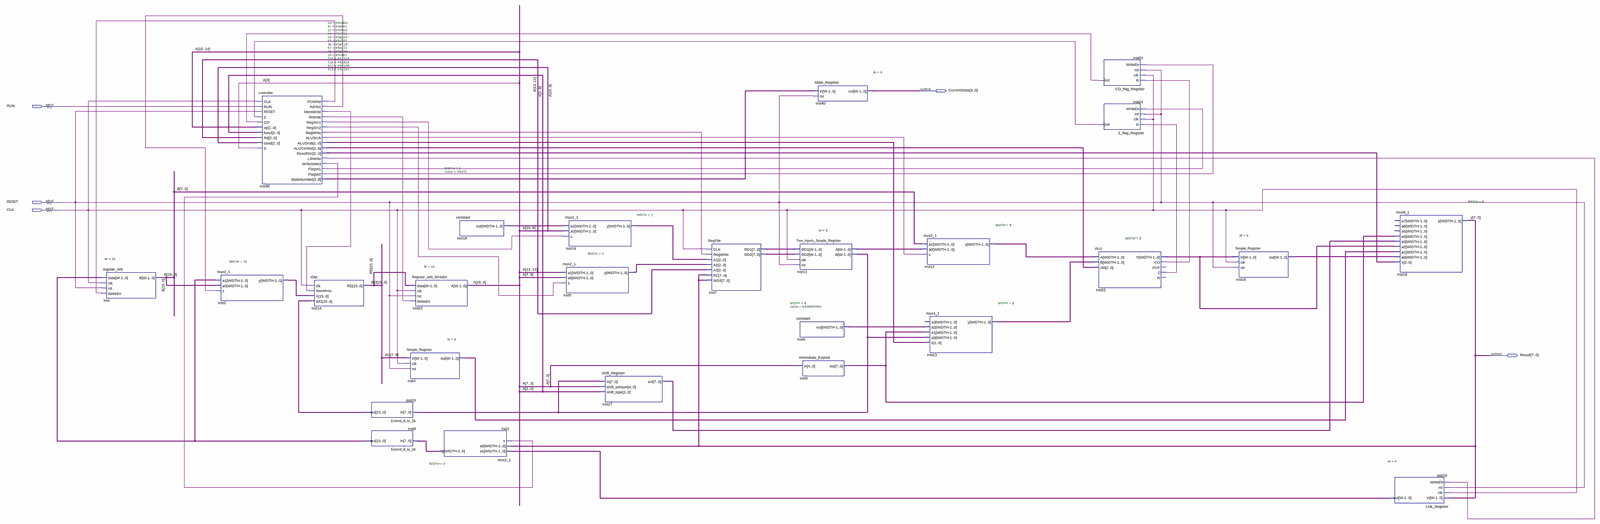
[diagram p0: schematic sheet, whole]
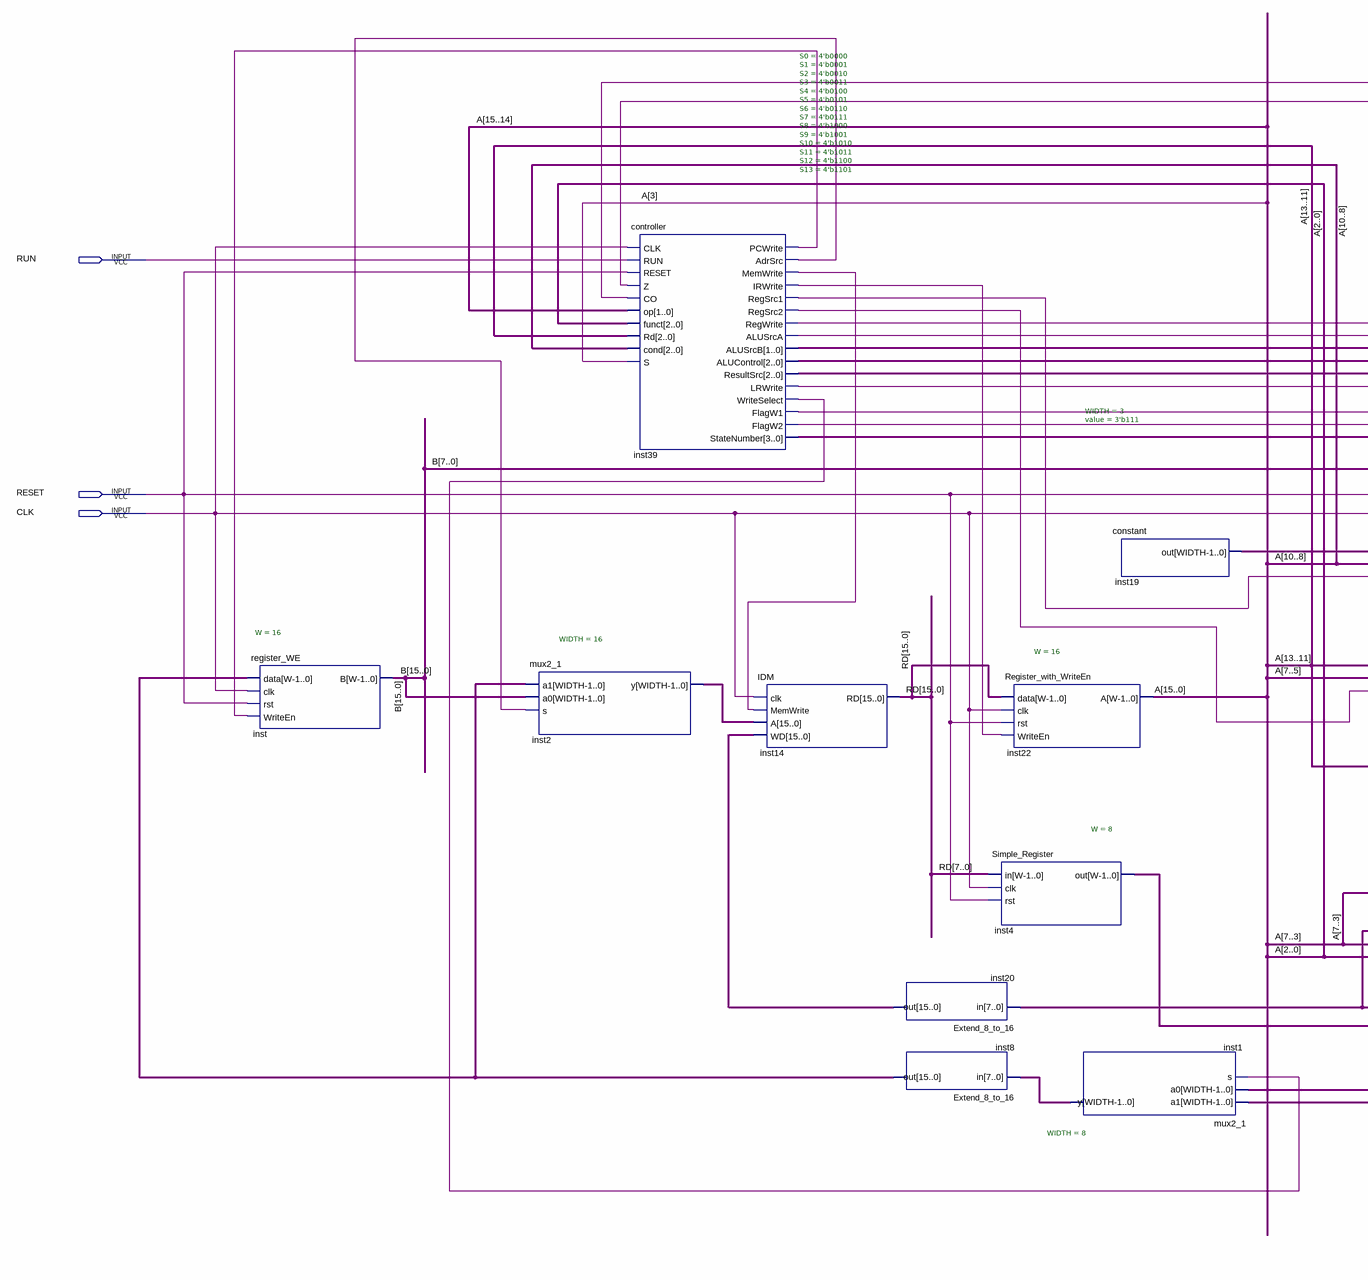
[diagram p1: schematic sheet, left part]
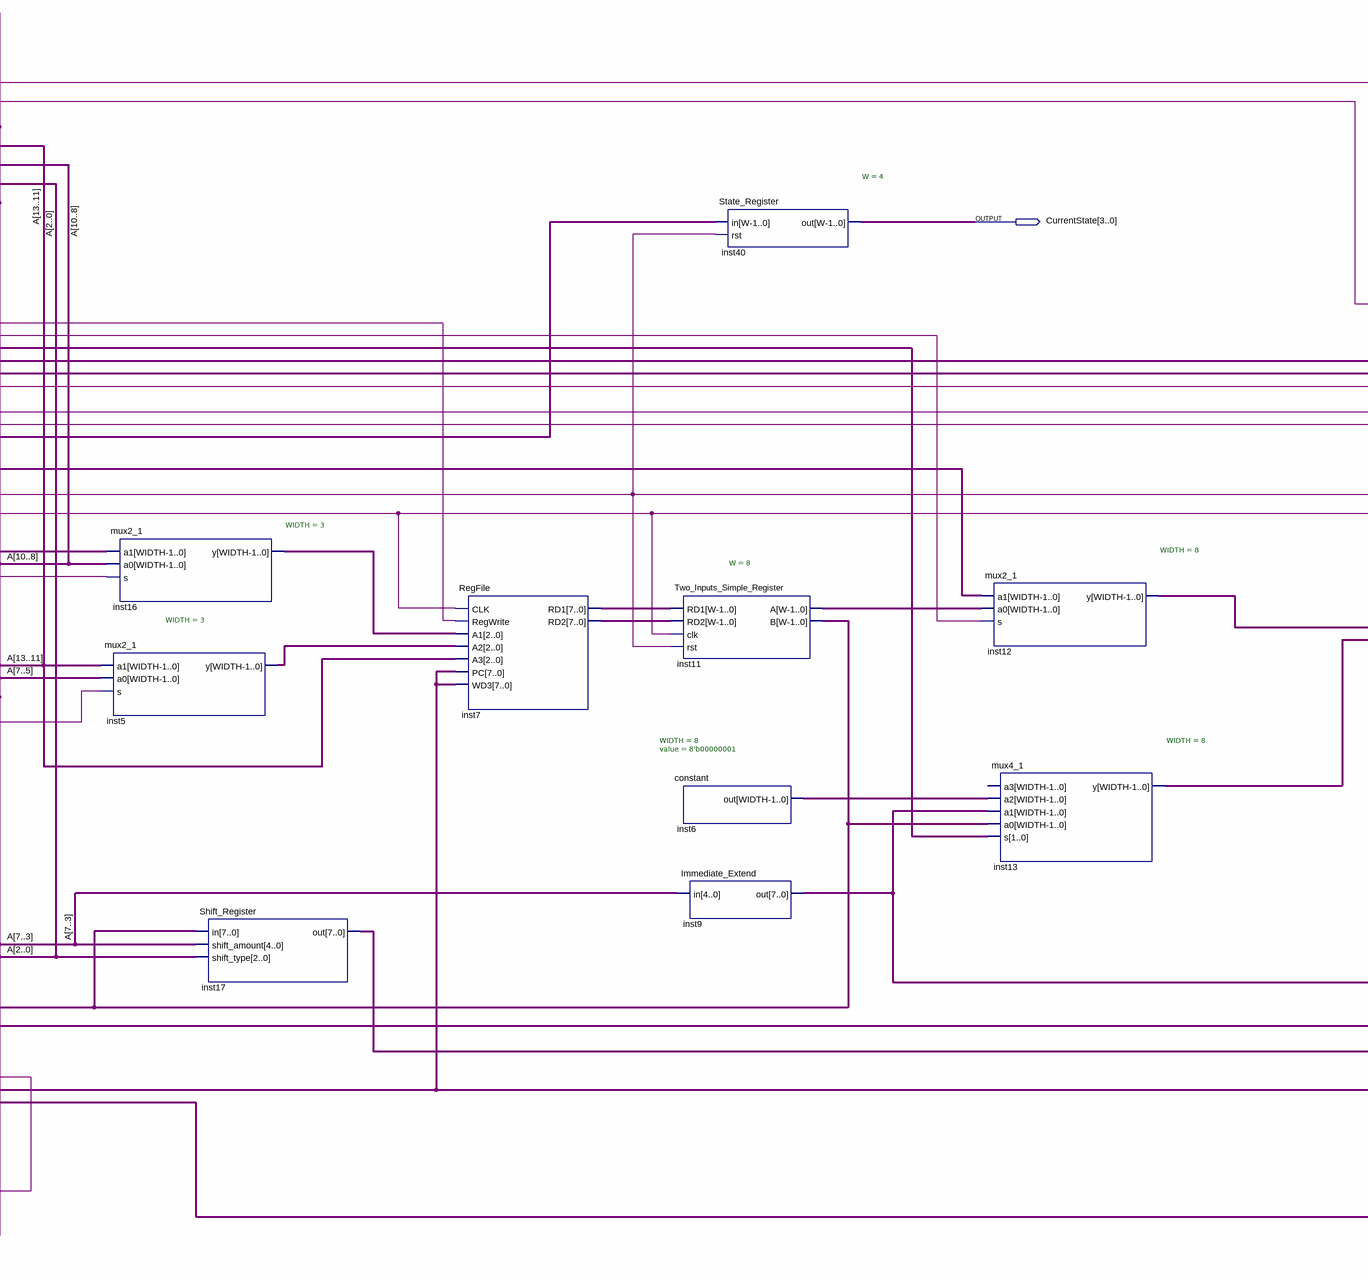
[diagram p2: schematic sheet, centre part]
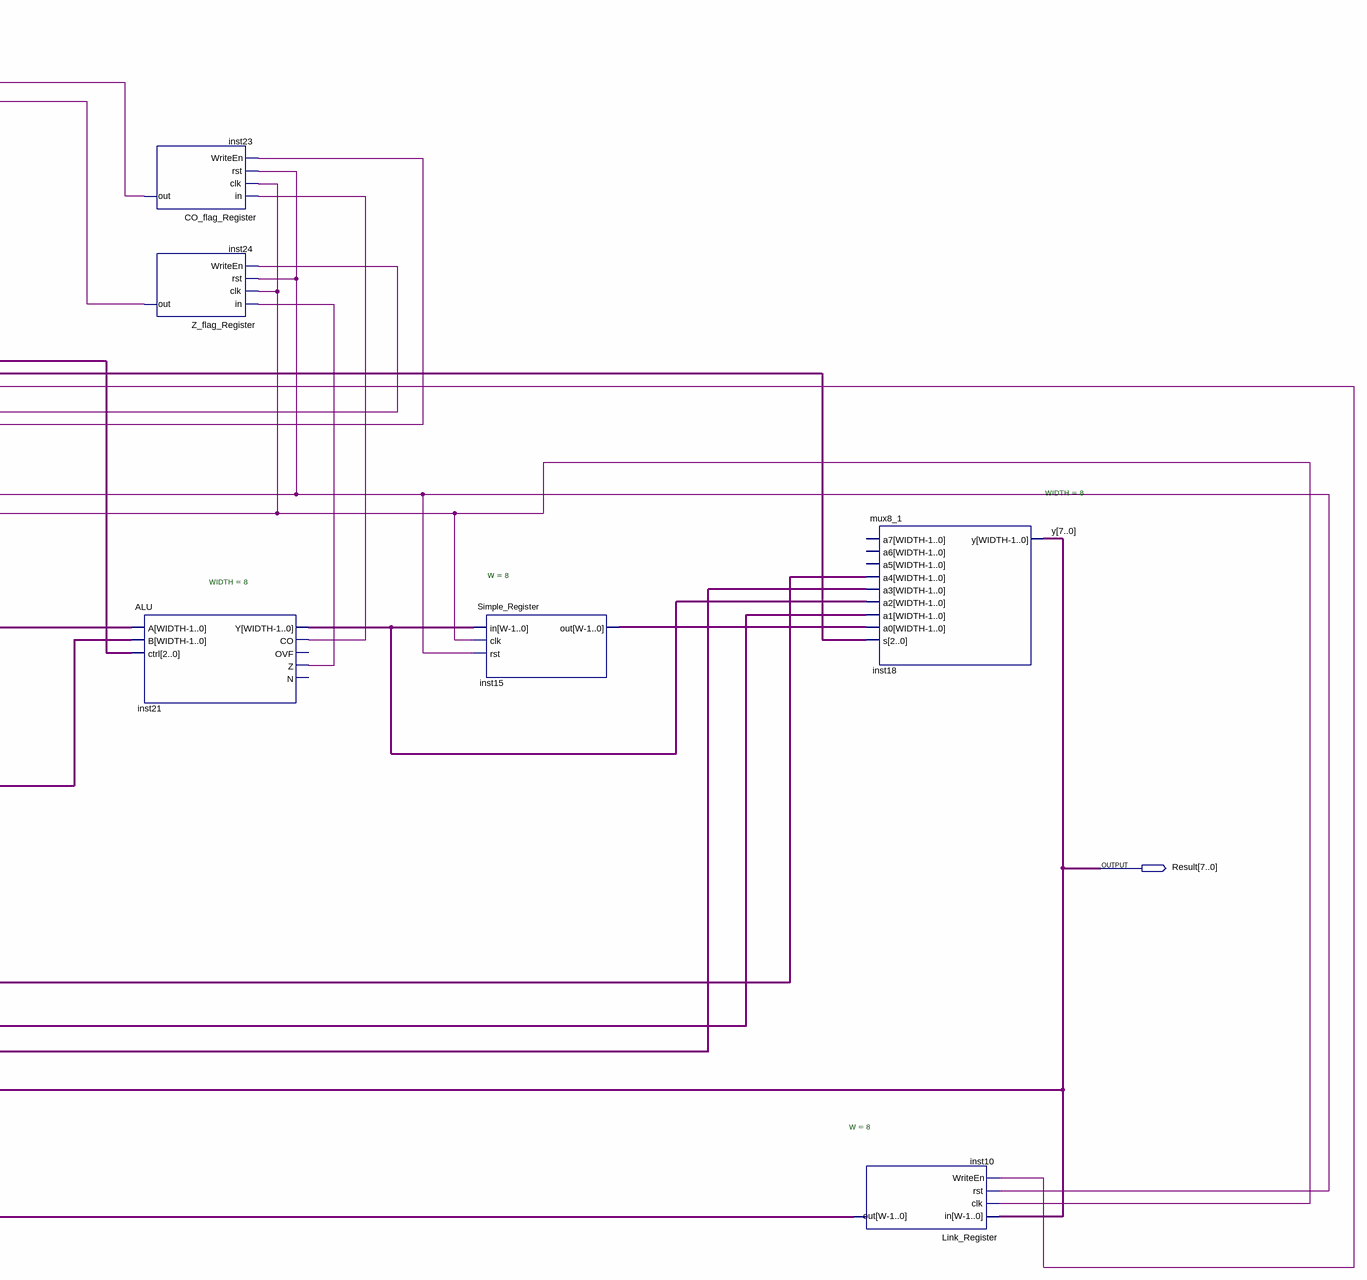
[diagram p3: schematic sheet, right part]
// Quartus schematic multicycle.bdf as structural Verilog: 26 symbols, 5 pins
module multicycle (
  input  RUN,
  input  RESET,
  input  CLK,
  output [3:0] CurrentState,
  output [7:0] Result
);

  wire inst21_co, inst21_z, inst23_out, inst24_out, inst39_adrsrc, inst39_alusrca, inst39_flagw1,
       inst39_flagw2, inst39_irwrite, inst39_lrwrite, inst39_memwrite, inst39_pcwrite, inst39_regsrc1,
       inst39_regsrc2, inst39_regwrite, inst39_writeselect;
  wire [1:0] inst39_alusrcb;
  wire [2:0] inst5_y, inst16_y, inst19_out, inst39_alucontrol, inst39_resultsrc;
  wire [3:0] inst39_statenumber;
  wire [7:0] inst1_y, inst4_out, inst6_out, inst7_rd1, inst7_rd2, inst9_out, inst10_out, inst11_a, inst11_b,
       inst12_y, inst13_y, inst15_out, inst17_out, inst21_y;
  wire [15:0] A, B, inst2_y, inst8_out, inst20_out, RD;

  register_WE #(.W(16)) inst (.data(inst8_out), .clk(CLK), .rst(RESET), .WriteEn(inst39_pcwrite), .B(B));
  mux2_1 #(.WIDTH(16)) inst2 (.a1(inst8_out), .a0(B), .s(inst39_adrsrc), .y(inst2_y));
  controller #(.S0(4'b0000), .S1(4'b0001), .S2(4'b0010), .S3(4'b0011), .S4(4'b0100), .S5(4'b0101), .S6(4'b0110), .S7(4'b0111), .S8(4'b1000), .S9(4'b1001), .S10(4'b1010), .S11(4'b1011), .S12(4'b1100), .S13(4'b1101)) inst39 (
    .CLK(CLK), .RUN(RUN), .RESET(RESET), .Z(inst24_out), .CO(inst23_out), .op(A[15:14]), .funct(A[2:0]),
    .Rd(A[13:11]), .cond(A[10:8]), .S(A[3]), .PCWrite(inst39_pcwrite), .AdrSrc(inst39_adrsrc),
    .MemWrite(inst39_memwrite), .IRWrite(inst39_irwrite), .RegSrc1(inst39_regsrc1), .RegSrc2(inst39_regsrc2),
    .RegWrite(inst39_regwrite), .ALUSrcA(inst39_alusrca), .ALUSrcB(inst39_alusrcb),
    .ALUControl(inst39_alucontrol), .ResultSrc(inst39_resultsrc), .LRWrite(inst39_lrwrite),
    .WriteSelect(inst39_writeselect), .FlagW1(inst39_flagw1), .FlagW2(inst39_flagw2),
    .StateNumber(inst39_statenumber));
  IDM inst14 (.clk(CLK), .MemWrite(inst39_memwrite), .A(inst2_y), .WD(inst20_out), .RD(RD));
  Extend_8_to_16 inst20 (.in(inst11_b), .out(inst20_out));
  Extend_8_to_16 inst8 (.in(inst1_y), .out(inst8_out));
  Register_with_WriteEn #(.W(16)) inst22 (.data(RD), .clk(CLK), .rst(RESET), .WriteEn(inst39_irwrite), .A(A));
  Simple_Register #(.W(8)) inst4 (.in(RD[7:0]), .clk(CLK), .rst(RESET), .out(inst4_out));
  mux2_1 #(.WIDTH(8)) inst1 (.a1(inst10_out), .a0(Result), .s(inst39_writeselect), .y(inst1_y));
  constant #(.WIDTH(3), .value(3'b111)) inst19 (.out(inst19_out));
  mux2_1 #(.WIDTH(3)) inst16 (.a1(inst19_out), .a0(A[10:8]), .s(inst39_regsrc1), .y(inst16_y));
  mux2_1 #(.WIDTH(3)) inst5 (.a1(A[13:11]), .a0(A[7:5]), .s(inst39_regsrc2), .y(inst5_y));
  Shift_Register inst17 (.in(inst11_b), .shift_amount(A[7:3]), .shift_type(A[2:0]), .out(inst17_out));
  RegFile inst7 (
    .CLK(CLK), .RegWrite(inst39_regwrite), .A1(inst16_y), .A2(inst5_y), .A3(A[13:11]), .PC(Result),
    .WD3(Result), .RD1(inst7_rd1), .RD2(inst7_rd2));
  Two_Inputs_Simple_Register #(.W(8)) inst11 (
    .RD1(inst7_rd1), .RD2(inst7_rd2), .clk(CLK), .rst(RESET), .A(inst11_a), .B(inst11_b));
  constant #(.WIDTH(8), .value(8'b00000001)) inst6 (.out(inst6_out));
  State_Register #(.W(4)) inst40 (.in(inst39_statenumber), .rst(RESET), .out(CurrentState));
  Immediate_Extend inst9 (.in(A[7:3]), .out(inst9_out));
  mux2_1 #(.WIDTH(8)) inst12 (.a1(B[7:0]), .a0(inst11_a), .s(inst39_alusrca), .y(inst12_y));
  mux4_1 #(.WIDTH(8)) inst13 (
    .a2(inst6_out), .a1(inst9_out), .a0(inst11_b), .s(inst39_alusrcb), .y(inst13_y));  // open: a3
  CO_flag_Register inst23 (.in(inst21_co), .clk(CLK), .rst(RESET), .WriteEn(inst39_flagw2), .out(inst23_out));
  Z_flag_Register inst24 (.in(inst21_z), .clk(CLK), .rst(RESET), .WriteEn(inst39_flagw1), .out(inst24_out));
  ALU #(.WIDTH(8)) inst21 (
    .A(inst12_y), .B(inst13_y), .ctrl(inst39_alucontrol), .Y(inst21_y), .CO(inst21_co), .Z(inst21_z));  // open: OVF, N
  Simple_Register #(.W(8)) inst15 (.in(inst21_y), .clk(CLK), .rst(RESET), .out(inst15_out));
  mux8_1 #(.WIDTH(8)) inst18 (
    .a4(inst9_out), .a3(inst17_out), .a2(inst21_y), .a1(inst4_out), .a0(inst15_out), .s(inst39_resultsrc),
    .y(Result));  // open: a7, a6, a5
  Link_Register #(.W(8)) inst10 (.in(Result), .clk(CLK), .rst(RESET), .WriteEn(inst39_lrwrite), .out(inst10_out));

  // Other names for the same wires on the sheet: y[7:0] = Result
endmodule
